# EAGLE design rest (EAGLE 8.7.1)
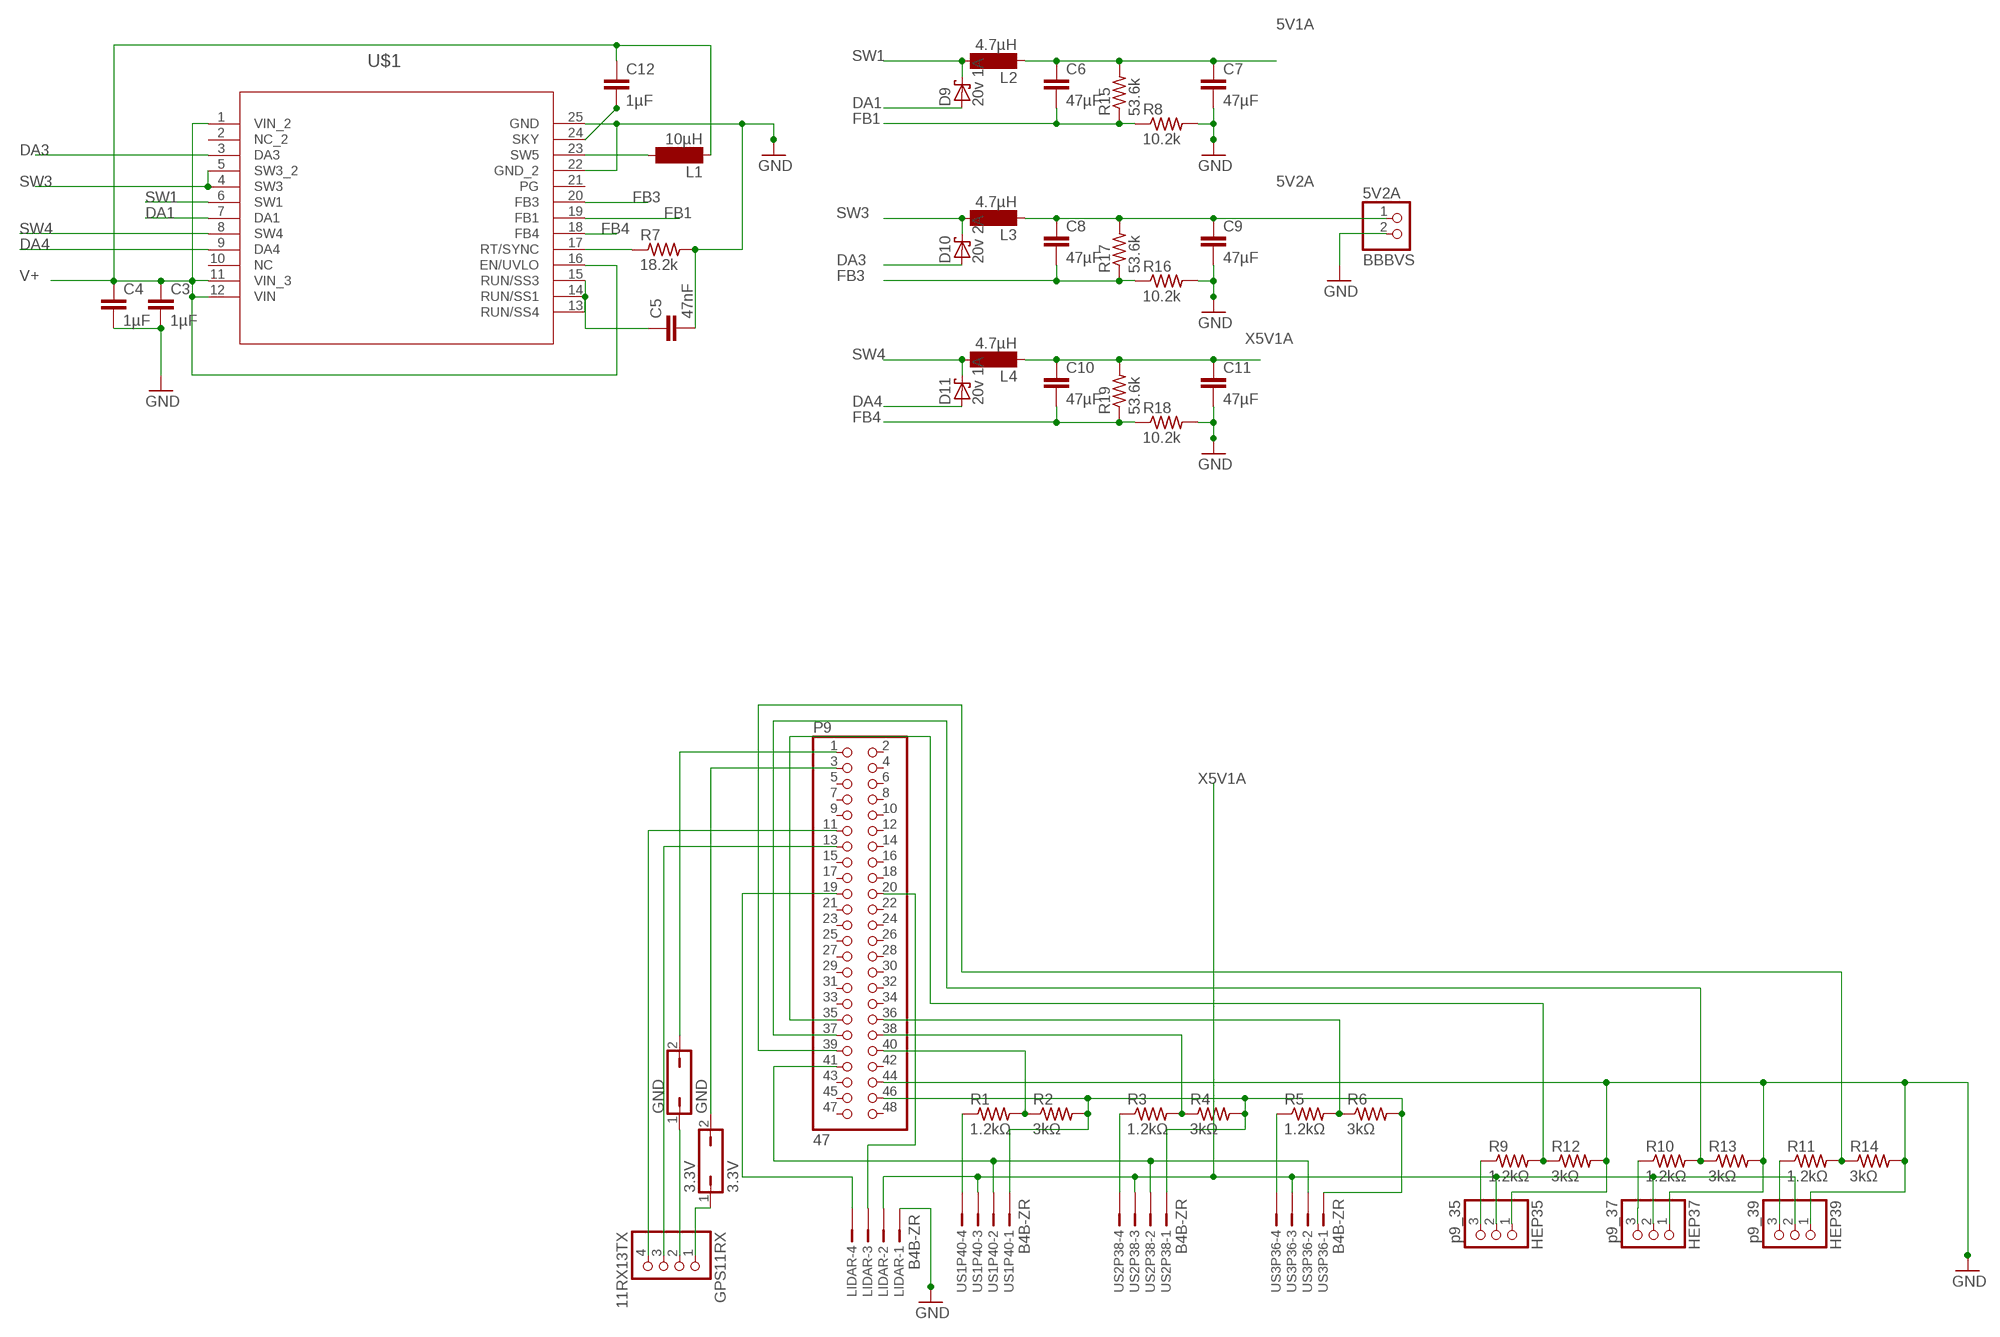
[diagram p0: schematic, sheet 1, part 1 of 2]
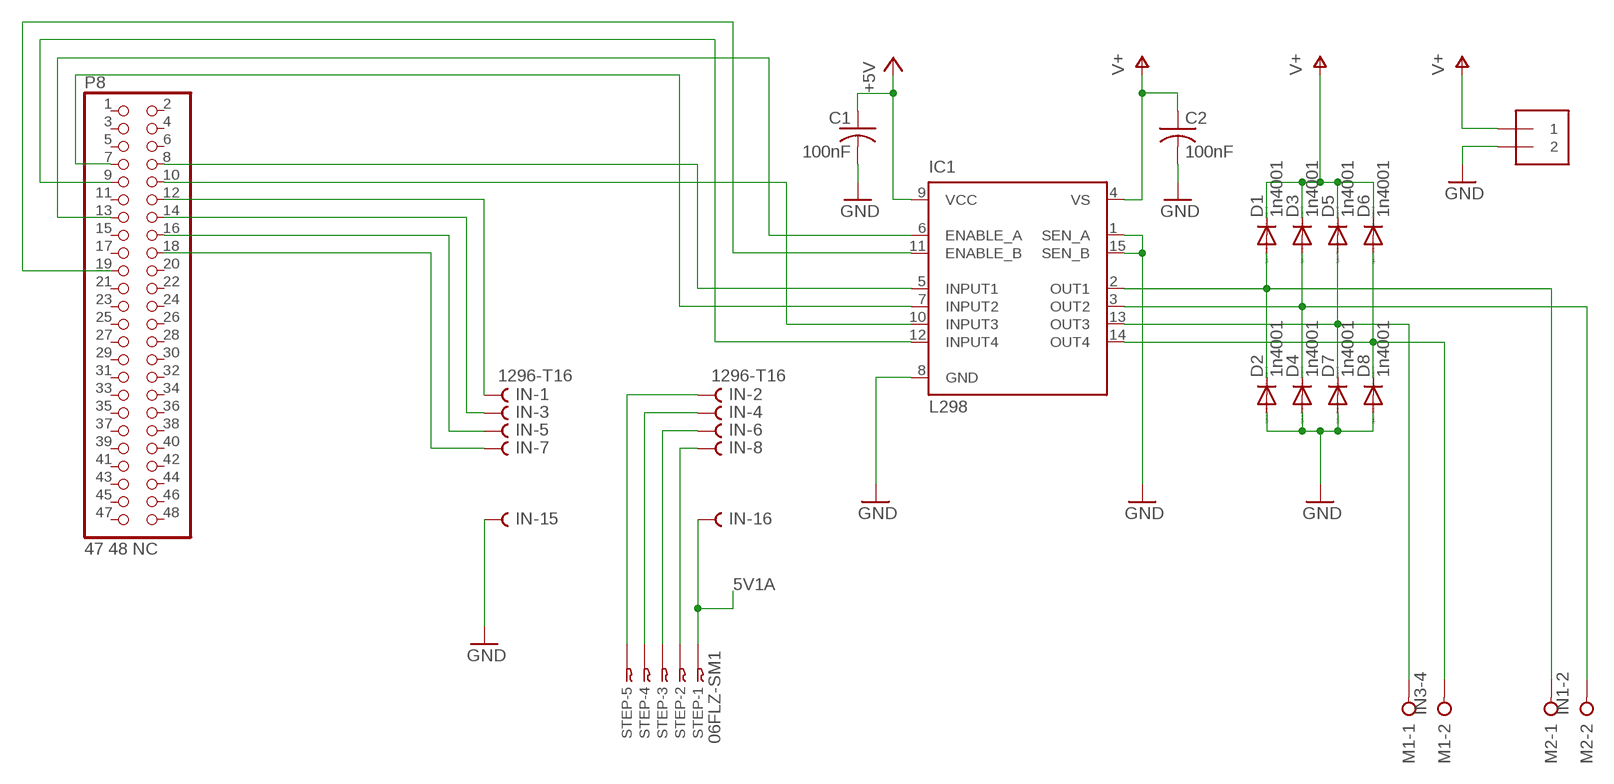
[diagram p1: schematic, sheet 1, part 2 of 2]

## Parts
3.3V  3.3V  JP1Q  [JP1]
5V2A  BBBVS  PINHD-1X2  [1X02]
C1  100nF  C-US050-024X044  [C050-024X044]
C2  100nF  C-US050-024X044  [C050-024X044]
C3  1µF  C2,5-3  [C2.5-3]
C4  1µF  C2,5-3  [C2.5-3]
C5  47nF  C2,5-3  [C2.5-3]
C6  47µF  C2,5-3  [C2.5-3]
C7  47µF  C2,5-3  [C2.5-3]
C8  47µF  C2,5-3  [C2.5-3]
C9  47µF  C2,5-3  [C2.5-3]
C10  47µF  C2,5-3  [C2.5-3]
C11  47µF  C2,5-3  [C2.5-3]
C12  1µF  C2,5-3  [C2.5-3]
D1  1n4001  DIODE-D-5  [D-5]
D2  1n4001  DIODE-D-5  [D-5]
D3  1n4001  DIODE-D-5  [D-5]
D4  1n4001  DIODE-D-5  [D-5]
D5  1n4001  DIODE-D-5  [D-5]
D6  1n4001  DIODE-D-5  [D-5]
D7  1n4001  DIODE-D-5  [D-5]
D8  1n4001  DIODE-D-5  [D-5]
D9  20v 1A  1N5819-T  [DO41-7.6]
D10  20v 2A  1N5819-T  [DO41-7.6]
D11  20v 1A  1N5819-T  [DO41-7.6]
GND  GND  JP1Q  [JP1]
GPS11RX  11RX13TX  PINHD-1X4  [1X04]
HEP35  p9_35  JST_3PIN  [JSTPH3]
HEP37  p9_37  JST_3PIN  [JSTPH3]
HEP39  p9_39  JST_3PIN  [JSTPH3]
IC1  L298  [MULTIWATT-15]
IN  1296-T16  [1296-18]
J1  1X2-3.5MM  [1X2-3.5MM]
L1  10µH  SM-L15A  [SM-L15A]
L2  4.7µH  SM-L15A  [SM-L15A]
L3  4.7µH  SM-L15A  [SM-L15A]
L4  4.7µH  SM-L15A  [SM-L15A]
LIDAR  B4B-ZR  [B4B-ZR]
M1  IN3-4  W237-02P  [W237-132]
M2  IN1-2  W237-02P  [W237-132]
P8  47 48 NC  PINHD-2X24  [2X24]
P9  47  PINHD-2X24  [2X24]
R1  1.2kΩ  R-US_0309/12  [0309/12]
R2  3kΩ  R-US_0309/12  [0309/12]
R3  1.2kΩ  R-US_0309/12  [0309/12]
R4  3kΩ  R-US_0309/12  [0309/12]
R5  1.2kΩ  R-US_0309/12  [0309/12]
R6  3kΩ  R-US_0309/12  [0309/12]
R7  18.2k  R-US_0204/5  [0204/5]
R8  10.2k  R-US_0204/5  [0204/5]
R9  1.2kΩ  R-US_0309/12  [0309/12]
R10  1.2kΩ  R-US_0309/12  [0309/12]
R11  1.2kΩ  R-US_0309/12  [0309/12]
R12  3kΩ  R-US_0309/12  [0309/12]
R13  3kΩ  R-US_0309/12  [0309/12]
R14  3kΩ  R-US_0309/12  [0309/12]
R15  53.6k  R-US_0204/5  [0204/5]
R16  10.2k  R-US_0204/5  [0204/5]
R17  53.6k  R-US_0204/5  [0204/5]
R18  10.2k  R-US_0204/5  [0204/5]
R19  53.6k  R-US_0204/5  [0204/5]
STEP  06FLZ-SM1  [6FLZ-SM]
U$1  LT3514  [TSSOP-24_FEAA]
US1P40  B4B-ZR  [B4B-ZR]
US2P38  B4B-ZR  [B4B-ZR]
US3P36  B4B-ZR  [B4B-ZR]

## Nets
5V1A: C6.1 C7.1 IN.16 L2.1 R15.2 STEP.1
5V2A: 5V2A.1 C8.1 C9.1 L3.1 R17.2
+5V: C1.1 IC1.9(VCC)
DA1: D9.A U$1.7(DA1)
DA3: D10.A U$1.3(DA3)
DA4: D11.A U$1.9(DA4)
FB1: C6.2 R8.1 R15.1 U$1.19(FB1)
FB3: C8.2 R16.1 R17.1 U$1.20(FB3)
FB4: C10.2 R18.1 R19.1 U$1.18(FB4)
GND: 5V2A.2 C1.2 C2.2 C3.2 C4.2 C5.2 C7.2 C9.2 C11.2 D2.A D4.A D7.A D8.A HEP35.1 HEP37.1 HEP39.1 IC1.1(SEN_A) IC1.8(GND) IC1.15(SEN_B) IN.15 J1.2 LIDAR.1 P9.44 R7.2 R8.2 R12.2 R13.2 R14.2 R16.2 R18.2 U$1.22(GND_2) U$1.25(GND)
N$1: P9.40 R1.2 R2.1
N$2: P9.38 R3.2 R4.1
N$3: P9.36 R5.2 R6.1
N$4: R1.1 US1P40.4
N$5: R3.1 US2P38.4
N$6: R5.1 US3P36.4
N$7: P9.46 R2.2 R4.2 R6.2 US1P40.1 US2P38.1 US3P36.1
N$8: P9.41 US1P40.2 US2P38.2 US3P36.2
N$9: D1.A D2.C IC1.2(OUT1) M2.1
N$10: D3.A D4.C IC1.3(OUT2) M2.2
N$11: P9.39 R11.2 R14.1
N$12: P9.37 R10.2 R13.1
N$13: P9.35 R9.2 R12.1
N$14: HEP35.3 R9.1
N$15: HEP37.3 R10.1
N$16: HEP39.3 R11.1
N$17: D6.A D8.C IC1.14(OUT4) M1.2
N$18: D5.A D7.C IC1.13(OUT3) M1.1
N$19: IC1.5(INPUT1) P8.8
N$20: IC1.7(INPUT2) P8.7
N$21: IC1.6(ENABLE_A) P8.13
N$22: IC1.10(INPUT3) P8.10
N$23: IC1.12(INPUT4) P8.9
N$24: IC1.11(ENABLE_B) P8.19
N$25: IN.7 P8.18
N$26: IN.3 P8.14
N$27: IN.1 P8.12
N$28: LIDAR.4 P9.19
N$29: IN.5 P8.16
N$30: IN.2 STEP.5
N$31: IN.4 STEP.4
N$32: IN.6 STEP.3
N$33: IN.8 STEP.2
N$34: LIDAR.3 P9.20
N$37: GPS11RX.4 P9.11
N$38: GPS11RX.3 P9.13
N$39: GND.2 P9.1
N$40: 3.3V.2 P9.3
N$41: GND.1 GPS11RX.2
N$42: 3.3V.1 GPS11RX.1
N$44: C12.2 U$1.24(SKY)
N$45: L1.2 U$1.23(SW5)
N$46: C5.1 U$1.13(RUN/SS4) U$1.14(RUN/SS1) U$1.15(RUN/SS3)
N$47: R7.1 U$1.17(RT/SYNC)
SW1: D9.C L2.2 U$1.6(SW1)
SW3: D10.C L3.2 U$1.4(SW3) U$1.5(SW3_2)
SW4: D11.C L4.2 U$1.8(SW4)
V+: C2.1 C3.1 C4.1 C12.1 D1.C D3.C D5.C D6.C IC1.4(VS) J1.1 L1.1 U$1.1(VIN_2) U$1.11(VIN_3) U$1.12(VIN) U$1.16(EN/UVLO)
X5V1A: C10.1 C11.1 HEP35.2 HEP37.2 HEP39.2 L4.1 LIDAR.2 R19.2 US1P40.3 US2P38.3 US3P36.3
Unconnected: IN.9 IN.10 IN.11 IN.12 IN.13 IN.14 IN.17 IN.18 P8.1 P8.2 P8.3 P8.4 P8.5 P8.6 P8.11 P8.15 P8.17 P8.20 P8.21 P8.22 P8.23 P8.24 P8.25 P8.26 P8.27 P8.28 P8.29 P8.30 P8.31 P8.32 P8.33 P8.34 P8.35 P8.36 P8.37 P8.38 P8.39 P8.40 P8.41 P8.42 P8.43 P8.44 P8.45 P8.46 P8.47 P8.48 P9.2 P9.4 P9.5 P9.6 P9.7 P9.8 P9.9 P9.10 P9.12 P9.14 P9.15 P9.16 P9.17 P9.18 P9.21 P9.22 P9.23 P9.24 P9.25 P9.26 P9.27 P9.28 P9.29 P9.30 P9.31 P9.32 P9.33 P9.34 P9.42 P9.43 P9.45 P9.47 P9.48 STEP.6 U$1.2(NC_2) U$1.10(NC) U$1.21(PG)

## Library data of the parts
3.3V GND = jumper:JP1Q: JUMPER
5V2A = pinhead:PINHD-1X2: PIN HEADER
C1 C2 = rcl:C-US: CAPACITOR, American symbol; SPICEPREFIX: C
C3-C12 = capacitor-wima:C: CAPACITOR naming: grid - package width
D1-D8 = diode:DIODE-: DIODE
D9-D11 = diode:1N581*: 1.0A SCHOTTKY BARRIER RECTIFIER Source: http://www.diodes.com/datasheets/ds23001.pdf
GPS11RX = pinhead:PINHD-1X4: PIN HEADER
HEP35 HEP37 HEP39 = adafruit:JST_3PIN
IC1 = st-microelectronics:L298: DUAL FULL-BRIDGE DRIVER; MPN: L298N; OC_FARNELL: 1589425; OC_NEWARK: 32M1527
IN = con-leotronics:1296-T16: 1.27mm SINGLE ROW FEMALE SOCKET Source: http://www.leotronics.co.uk/Conexcon/Data%20Sheets/sec.%20A/1296ing.pdf; OC_FARNELL: unknown; OC_NEWARK: unknown
J1 = adafruit:1X2: 3.5mm Terminal block http://www.ladyada.net/library/pcb/eaglelibrary.html
L1-L4 = inductor-neosid:SM-L15: INDUCTOR SMD air coil with pick and place cap; OC_FARNELL: unknown; OC_NEWARK: unknown
LIDAR US1P40 US2P38 US3P36 = con-jst:?4B-ZR: ZH CONNECTOR 1.5 mm, 4 pin 1 row Source: http://www.jst.com .. eZH.pdf; MF: FARNELL; MPN: B4B-ZR(LF)(SN); OC_FARNELL: 1830916; OC_NEWARK: 37K9960
M1 M2 = con-wago-508:W237-02P: WAGO SREW CLAMP; OC_FARNELL: unknown; OC_NEWARK: unknown
P8 P9 = pinhead:PINHD-2X24: PIN HEADER
R1-R19 = resistor:R-US_: RESISTOR, American symbol
STEP = con-jst:06FLZ-SM1: CONNECTOR; OC_FARNELL: unknown; OC_NEWARK: unknown
U$1 = LT3514:LT3514: d

## Module LT3514
Ports: 

### Library data of the parts

## Board
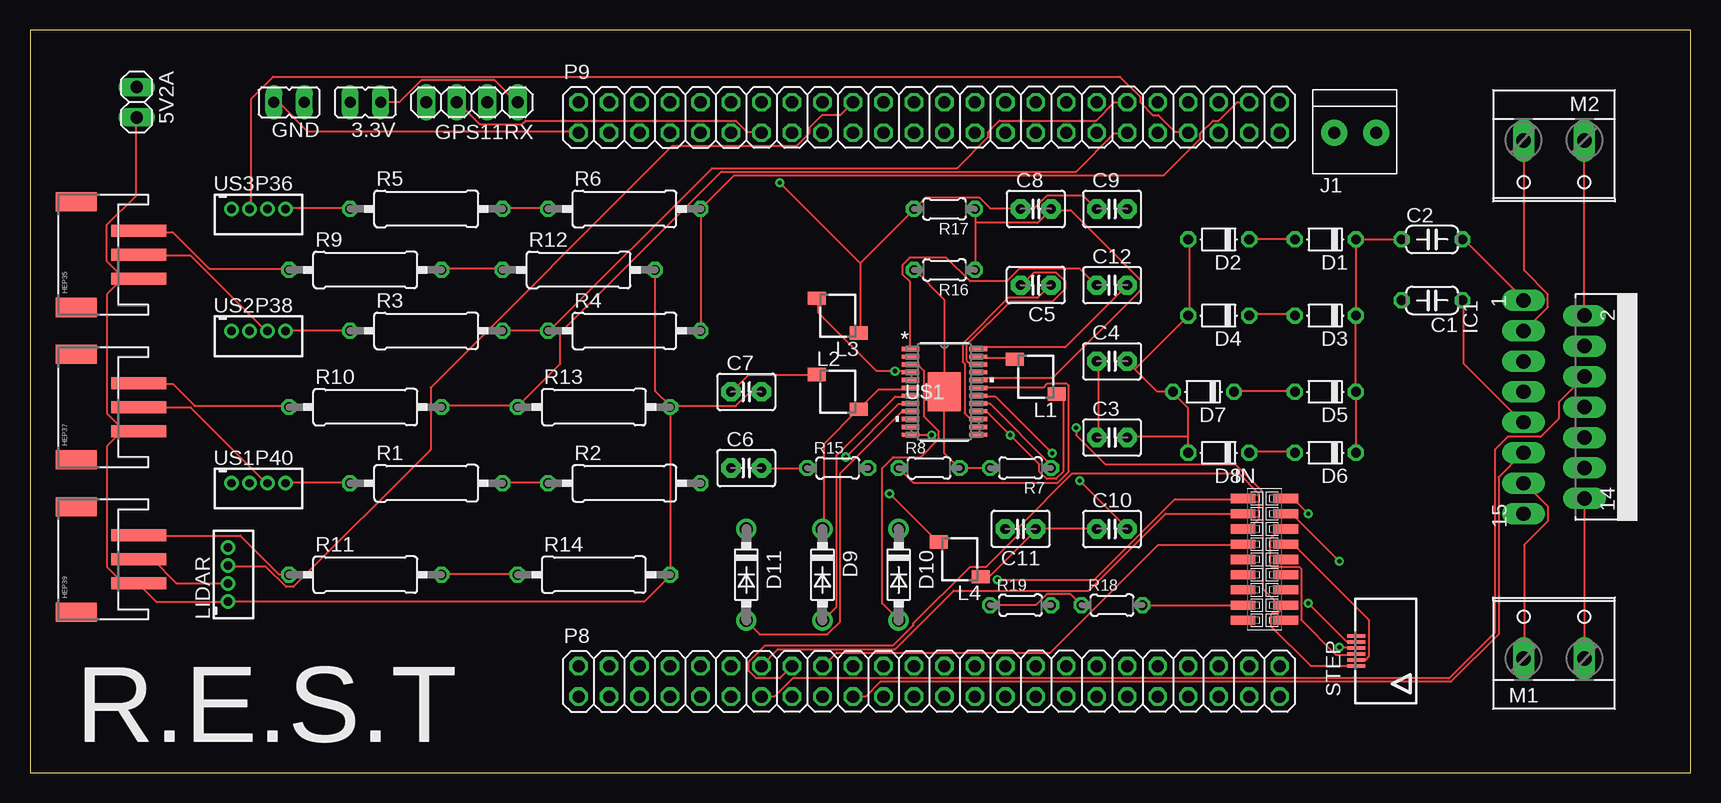
[diagram p2: board, top side]
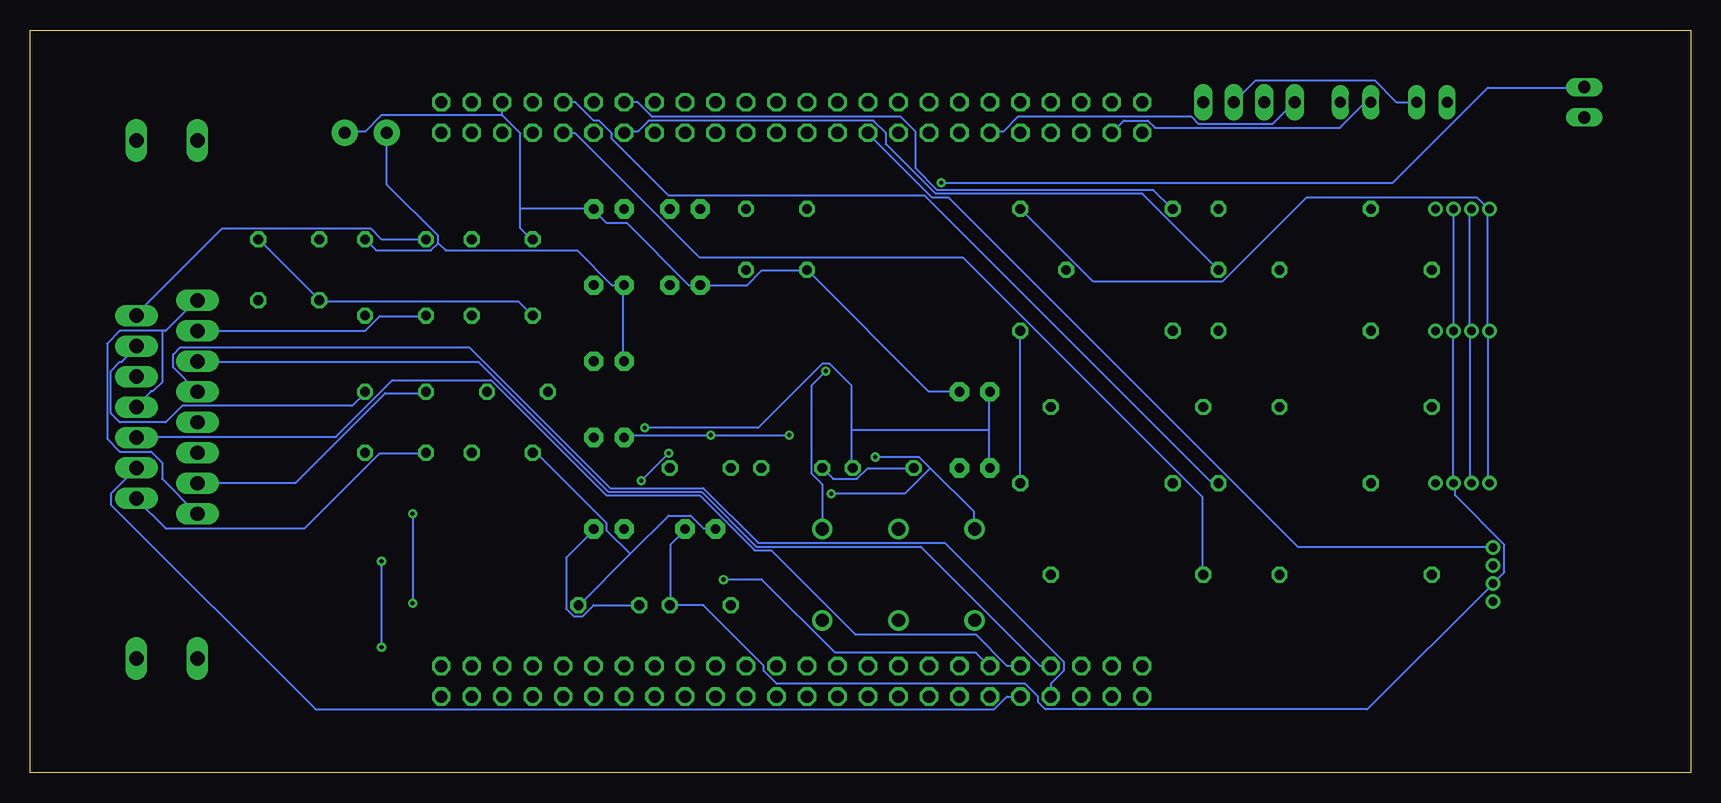
[diagram p3: board, bottom side, seen from below]

Size 138.41 x 61.9 mm. Coordinates in mm from the lower left corner, seen from the top.
Outline: 0,0 138.41,0 138.41,61.9 0,61.9 0,0
Copper layers (1*16): Top 0.035mm / dielectric 1.5mm / Bottom 0.035mm
Design rules "default": minimum track width 6mil, minimum drill 0.35mm, track to track 6mil, track to pad 6mil, pad to pad 6mil, via to via 6mil, smd to smd 6mil, copper to edge 40mil, drill to drill 6mil, minimum pad ring 10mil, minimum via ring 8mil, stop-mask expansion 4mil, vias tented up to drill 0mil, thermal gap 10mil

### Footprints (pad centres in the part's own frame; a part is rotated, then mirrored left to right if it is on the bottom)
JP1 = drill 0.914 long: 1 0,-1.27; 2 0,1.27
1X02 = drill 1.016 long: 1 -1.27,0; 2 1.27,0
C050-024X044 = drill 0.813 octagon: 1 -2.54,0; 2 2.54,0
C2.5-3 = drill 0.813 pad 1.6 octagon: 1 -1.27,0; 2 1.27,0
D-5 = drill 0.813 octagon: A 2.54,0; C -2.54,0
DO41-7.6 = drill 1.1 pad 1.7: A 3.81,0; C -3.81,0
1X04 = drill 1.016 long: 1 -3.81,0; 2 -1.27,0; 3 1.27,0; 4 3.81,0
JSTPH3 = smd 1 x 4.6: 1 -2,-2.7; 2 0,-2.7; 3 2,-2.7 | smd 1.6 x 3.4: NC1 -4.4,2.5; NC2 4.4,2.5
MULTIWATT-15 = drill 1.2 long: 1 -8.89,-7.62; 2 -7.62,-2.54; 3 -6.35,-7.62; 4 -5.08,-2.54; 5 -3.81,-7.62; 6 -2.54,-2.54; 7 -1.27,-7.62; 8 0,-2.54; 9 1.27,-7.62; 10 2.54,-2.54; 11 3.81,-7.62; 12 5.08,-2.54; 13 6.35,-7.62; 14 7.62,-2.54; 15 8.89,-7.62
1296-18 = smd 0.76 x 2.05: 1 -5.08,-1.78; 2 -5.08,1.78; 3 -3.81,-1.78; 4 -3.81,1.78; 5 -2.54,-1.78; 6 -2.54,1.78; 7 -1.27,-1.78; 8 -1.27,1.78; 9 0,-1.78; 10 0,1.78; 11 1.27,-1.78; 12 1.27,1.78; 13 2.54,-1.78; 14 2.54,1.78; 15 3.81,-1.78; 16 3.81,1.78; 17 5.08,-1.78; 18 5.08,1.78
1X2-3.5MM = drill 1 pad 2.184: 1 1.8,0; 2 -1.7,0
SM-L15A = smd 1.1 x 1.5: 1 -1.45,-1.75; 2 1.45,1.75
B4B-ZR = drill 0.7 pad 1.1: 1 -2.25,0; 2 -0.75,0; 3 0.75,0; 4 2.25,0
W237-132 = drill 1.194 long: 1 -2.54,-0.635; 2 2.54,-0.635
2X24 = drill 1.016 octagon: 1 -27.94,-1.27; 2 -27.94,1.27; 3 -25.4,-1.27; 4 -25.4,1.27; 5 -22.86,-1.27; 6 -22.86,1.27; 7 -20.32,-1.27; 8 -20.32,1.27; 9 -17.78,-1.27; 10 -17.78,1.27; 11 -15.24,-1.27; 12 -15.24,1.27; 13 -12.7,-1.27; 14 -12.7,1.27; 15 -10.16,-1.27; 16 -10.16,1.27; 17 -7.62,-1.27; 18 -7.62,1.27; 19 -5.08,-1.27; 20 -5.08,1.27; 21 -2.54,-1.27; 22 -2.54,1.27; 23 0,-1.27; 24 0,1.27; 25 2.54,-1.27; 26 2.54,1.27; 27 5.08,-1.27; 28 5.08,1.27; 29 7.62,-1.27; 30 7.62,1.27; 31 10.16,-1.27; 32 10.16,1.27; 33 12.7,-1.27; 34 12.7,1.27; 35 15.24,-1.27; 36 15.24,1.27; 37 17.78,-1.27; 38 17.78,1.27; 39 20.32,-1.27; 40 20.32,1.27; 41 22.86,-1.27; 42 22.86,1.27; 43 25.4,-1.27; 44 25.4,1.27; 45 27.94,-1.27; 46 27.94,1.27; 47 30.48,-1.27; 48 30.48,1.27
0309/12 = drill 0.813 octagon: 1 -6.35,0; 2 6.35,0
0204/5 = drill 0.813 octagon: 1 -2.54,0; 2 2.54,0
6FLZ-SM = smd 0.3 x 1.5: 1 -1.25,2.5; 2 -0.75,2.5; 3 -0.25,2.5; 4 0.25,2.5; 5 0.75,2.5; 6 1.25,2.5
TSSOP-24_FEAA = smd 1.473 x 0.356: 1 -2.819,3.576; 2 -2.819,2.926; 3 -2.819,2.276; 4 -2.819,1.626; 5 -2.819,0.975; 6 -2.819,0.325; 7 -2.819,-0.325; 8 -2.819,-0.975; 9 -2.819,-1.626; 10 -2.819,-2.276; 11 -2.819,-2.926; 12 -2.819,-3.576; 13 2.819,-3.576; 14 2.819,-2.926; 15 2.819,-2.276; 16 2.819,-1.626; 17 2.819,-0.975; 18 2.819,-0.325; 19 2.819,0.325; 20 2.819,0.975; 21 2.819,1.626; 22 2.819,2.276; 23 2.819,2.926; 24 2.819,3.576 | smd 2.743 x 3.251: 25 0,0

### Placement (x,y rotation side)
3.3V  27.94,55.88 90 top
5V2A  8.89,55.88 270 top
C1  116.84,39.37 180 top
C2  116.84,44.45 0 top
C3  90.17,27.94 0 top
C4  90.17,34.29 0 top
C5  83.82,40.64 180 top
C6  59.69,25.4 0 top
C7  59.69,31.75 0 top
C8  83.82,46.99 0 top
C9  90.17,46.99 0 top
C10  90.17,20.32 0 top
C11  82.55,20.32 180 top
C12  90.17,40.64 0 top
D1  107.95,44.45 180 top
D2  99.06,44.45 180 top
D3  107.95,38.1 180 top
D4  99.06,38.1 180 top
D5  107.95,31.75 180 top
D6  107.95,26.67 180 top
D7  97.79,31.75 180 top
D8  99.06,26.67 180 top
D9  66.04,16.51 270 top
D10  72.39,16.51 270 top
D11  59.69,16.51 270 top
GND  21.59,55.88 90 top
GPS11RX  36.83,55.88 180 top
HEP35  6.35,43.18 90 top
HEP37  6.35,30.48 90 top
HEP39  6.35,17.78 90 top
IC1  132.08,30.48 270 top
IN  102.87,17.78 270 top
J1  110.49,53.34 180 top
L1  83.82,33.02 90 top
L2  67.31,31.75 270 top
L3  67.31,38.1 90 top
L4  77.47,17.78 90 top
LIDAR  16.51,16.51 90 top
M1  127,10.16 0 top
M2  127,52.07 180 top
P8  73.66,7.62 0 top
P9  73.66,54.61 0 top
R1  33.02,24.13 0 top
R2  49.53,24.13 0 top
R3  33.02,36.83 0 top
R4  49.53,36.83 0 top
R5  33.02,46.99 0 top
R6  49.53,46.99 0 top
R7  82.55,25.4 180 top
R8  74.93,25.4 0 top
R9  27.94,41.91 0 top
R10  27.94,30.48 0 top
R11  27.94,16.51 0 top
R12  45.72,41.91 0 top
R13  46.99,30.48 0 top
R14  46.99,16.51 0 top
R15  67.31,25.4 0 top
R16  76.2,41.91 180 top
R17  76.2,46.99 180 top
R18  90.17,13.97 0 top
R19  82.55,13.97 0 top
STEP  113.03,10.16 90 top
U$1  76.2,31.75 0 top
US1P40  19.05,24.13 0 top
US2P38  19.05,36.83 0 top
US3P36  19.05,46.99 0 top

### Tracks (layer width: path | path; a pad name or v marks a point on that pad's centre or on a via)
5V1A  (via drill 0.35)
  Top 0.152: L2.1 65.53,33.17 59.89,33.17 58.52,31.8 C7.1 | v87.17,28.75 87.17,28.14 89.61,25.71 100.43,25.71 102.72,23.42 102.72,15.34 104.09,13.97 IN.16 103.99,13.31 103.53,13.31 103.4,13.17 103.4,12.22 106.71,8.91 STEP.1
  Bottom 0.152: 58.52,28.6 58.52,31.65 C7.1 | 58.52,28.6 58.52,25.4 C6.1 | v87.17,28.75 77.72,28.75 72.39,34.09 71.78,34.09 69.95,32.26 69.95,28.6 | 69.95,28.6 69.95,25.4 R15.2 | 69.95,28.6 58.52,28.6
5V2A  (via drill 0.35)
  Top 0.152: C9.1 87.78,48.11 84.73,48.11 83.67,47.04 82.6,47.04 C8.1 82.45,47.04 80.01,47.04 79.1,47.95 74.68,47.95 73.76,47.04 R17.2 73.61,46.89 69.19,42.47 | 69.19,42.47 69.19,36.68 L3.1 | 69.19,42.47 v62.48,49.17
  Bottom 0.152: v62.48,49.17 24.84,49.17 16.92,57.1 8.99,57.1 5V2A.1
+5V
  Top 0.152: C1.1 119.48,39.27 119.48,34.09 124.36,29.21 IC1.9
DA1
  Top 0.152: U$1.7 73.3,31.34 72.08,31.34 67.21,26.47 67.21,13.82 66.14,12.75 D9.A
DA3
  Top 0.152: U$1.3 73.46,33.93 74.07,33.93 74.52,33.48 74.52,29.67 75.74,28.45 75.74,27.84 74.22,26.31 71.93,26.31 71.02,25.4 71.02,14.12 72.39,12.75 D10.A
DA4
  Top 0.152: U$1.9 72.69,30.12 67.51,24.94 67.51,12.6 66.45,11.53 60.81,11.53 59.74,12.6 D11.A
FB1
  Top 0.152: C6.2 R15.1 | R8.1 73.61,24.18 85.65,24.18 86.56,25.09 86.56,32.26 86.41,32.41 84.73,32.41 84.43,32.11 79.1,32.11 U$1.19
  Bottom 0.152: R15.1 68.58,25.4 69.49,24.49 71.48,24.49 R8.1
FB3
  Top 0.152: 78.79,45.82 78.79,46.89 R17.1 | 78.79,45.82 78.79,42.01 R16.1 | U$1.20 79.1,32.87 85.19,32.87 92.51,40.18 92.51,41.1 86.72,46.89 85.19,46.89 C8.2 85.04,46.89 83.97,45.82 78.79,45.82
FB4  (via drill 0.35)
  Top 0.152: R19.1 83.82,13.97 84.73,14.88 86.72,14.88 R18.1 | v85.19,26.62 80.47,31.34 79.1,31.34 U$1.18 | v87.48,24.33 91.44,20.37 C10.2
  Bottom 0.152: v87.48,24.33 v85.19,26.62 | R18.1 91.44,13.97 92.35,13.06 93.12,13.06 93.73,13.66 93.73,17.93 91.44,20.22 C10.2
GND
  Top 0.152: 7.77,41.25 6.4,42.62 6.4,45.67 8.84,48.11 8.84,54.51 5V2A.2 | 7.77,41.25 8.99,41.25 HEP35.1 7.77,41.25 | 7.77,28.6 8.99,28.6 HEP37.1 7.77,28.6 | 7.77,28.6 6.4,29.97 6.4,39.88 7.77,41.25 | 7.77,28.6 6.4,27.23 6.4,17.17 7.77,15.8 8.99,15.8 HEP39.1 9.14,15.65 10.52,14.27 16.46,14.27 LIDAR.1 16.61,14.27 51.21,14.27 53.34,16.41 R14.2 R13.2 53.34,30.58 | C2.2 119.48,44.45 124.51,39.42 IC1.1 | 53.34,30.58 52.12,31.8 52.12,41.86 R12.2 | 53.34,30.58 58.83,30.58 59.89,31.65 60.96,31.65 C7.2 | R7.2 R8.2 77.42,25.4 76.2,26.62 U$1.25 76.2,39.42 73.76,41.86 R16.2 | U$1.22 78.94,34.09 78.33,34.09 78.03,34.39 78.03,35.61 81.69,39.27 85.19,39.27 86.26,40.33 86.26,40.94 85.5,41.71 83.67,41.71 82.6,40.64 C5.2 | R18.2 IN.15 | 92.05,33.63 91.44,34.24 C4.2 | 92.05,33.63 93.88,31.8 95.25,31.8 D7.A 95.25,31.65 96.47,30.43 96.47,27.99 | 96.47,27.99 96.47,26.77 D8.A | 96.47,27.99 91.44,27.99 C3.2 | D2.A 96.62,44.45 96.62,38.2 D4.A 92.05,33.63
  Bottom 0.152: C2.2 119.33,44.45 114.3,39.42 C1.2 114.3,39.27 97.69,39.27 D4.A | 127.41,36.83 127.1,36.83 124.51,39.42 IC1.1 | 127.41,36.83 130.91,36.83 131.98,35.76 131.98,27.84 130.91,26.77 128.32,26.77 127.41,25.86 127.41,24.49 124.51,21.59 IC1.15 | 127.41,36.83 127.41,32.56 128.17,31.8 128.32,31.8 129.54,30.58 IC1.8 | 88.39,18.24 92.66,13.97 R18.2 | 88.39,18.24 85.19,21.44 83.36,21.44 82.3,20.37 81.38,20.37 C11.2 | 99.06,54.81 P9.44 | 99.06,54.81 97.54,53.29 97.54,47.04 | 97.54,47.04 97.54,45.36 96.62,44.45 D2.A | 97.54,47.04 91.44,47.04 C9.2 91.44,46.89 90.37,45.82 88.7,45.82 83.52,40.64 C5.2 78.64,40.64 77.42,41.86 73.76,41.86 R16.2 63.55,31.8 60.96,31.8 C7.2 | 99.06,54.81 109.12,54.81 110.49,53.44 112.17,53.44 J1.2 | 88.39,18.24 90.37,20.22 90.37,20.83 96.16,26.62 96.47,26.62 D8.A
N$1
  Top 0.152: R1.2 39.47,24.18 43.13,24.18 R2.1
  Bottom 0.152: P9.40 92.96,55.88 91.44,54.36 90.98,54.36 89.92,53.29 89.92,52.83 85.19,48.11 63.86,48.11 39.93,24.18 39.47,24.18 R1.2
N$2
  Top 0.152: R3.2 R4.1 43.28,36.83 56.85,50.39 77.27,50.39 79.86,52.98 79.86,53.44 80.77,54.36 88.85,54.36 90.37,55.88 P9.38
N$3
  Top 0.152: R5.2 39.47,47.04 43.13,47.04 R6.1
  Bottom 0.152: P9.36 87.78,55.88 86.56,54.66 65.84,54.66 64.62,53.44 64.62,50.39 62.79,48.56 44.81,48.56 43.28,47.04 R6.1
N$4
  Top 0.152: US1P40.4 21.34,24.18 26.67,24.18 R1.1
N$5
  Top 0.152: R3.1 US2P38.4
N$6
  Top 0.152: US3P36.4 21.34,47.04 26.67,47.04 R5.1
N$7
  Top 0.152: R4.2 55.93,36.83 55.93,46.89 R6.2 58.67,49.78 94.49,49.78 97.54,52.83 97.54,53.29 98.6,54.36 99.06,54.36 100.58,55.88 P9.46
  Bottom 0.152: 16.92,36.83 16.92,24.18 US1P40.1 | 16.92,36.83 16.92,46.89 US3P36.1 16.92,47.04 17.83,47.95 32,47.95 39.01,40.94 49.84,40.94 R6.2 | 16.92,36.83 US2P38.1 | R2.2 55.93,24.18 55.93,36.83 R4.2
N$8
  Top 0.152: P9.41 96.47,53.44 95.4,53.44 94.03,54.81 93.57,54.81 92.51,55.88 92.51,56.34 90.83,58.01 20.27,58.01 18.44,56.18 18.44,47.04 US3P36.2
  Bottom 0.152: 18.44,36.83 18.44,24.18 US1P40.2 | 18.44,36.83 18.44,46.89 US3P36.2 | 18.44,36.83 US2P38.2
N$9
  Top 0.152: D1.A D2.C | IC1.2 M2.1
  Bottom 0.152: D1.A 109.12,44.45 110.03,45.36 122.38,45.36 129.54,38.2 IC1.2
N$10
  Top 0.152: D4.C 101.65,38.2 105.31,38.2 D3.A | M2.2 124.51,52.68 124.51,41.86 126.49,39.88 126.49,38.81 124.51,36.83 IC1.3
  Bottom 0.152: IC1.3 110.49,36.83 109.27,38.05 105.46,38.05 D3.A
N$11
  Top 0.152: R11.2 34.29,16.56 40.54,16.56 R14.1
  Bottom 0.152: P9.39 93.88,53.29 92.96,53.29 82.6,42.93 60.66,42.93 40.69,22.96 40.69,16.56 R14.1
N$12
  Top 0.152: R10.2 34.29,30.58 40.54,30.58 R13.1 40.69,30.58 44.2,34.09 44.2,36.68 57.61,50.09 87.17,50.09 90.37,53.29 91.44,53.29 P9.37
N$13
  Top 0.152: R9.2 34.29,42.01 39.32,42.01 R12.1
  Bottom 0.152: R12.1 45.72,48.26 62.94,48.26 67.06,52.38 67.06,53.29 68.12,54.36 86.87,54.36 87.78,53.44 88.85,53.44 P9.35
N$14
  Top 0.152: R9.1 21.49,42.01 14.93,42.01 11.89,45.06 9.14,45.06 HEP35.3
N$15
  Top 0.152: R10.1 21.49,30.58 13.72,30.58 11.89,32.41 9.14,32.41 HEP37.3
N$16
  Top 0.152: R11.1 21.49,16.56 20.73,16.56 17.53,19.76 9.14,19.76 HEP39.3
N$17
  Top 0.152: D8.C 101.65,26.77 105.31,26.77 D6.A | IC1.14 M1.2
  Bottom 0.152: D6.A 105.46,26.62 109.27,26.62 115.52,20.37 127.1,20.37 129.54,22.81 IC1.14
N$18
  Top 0.152: D7.C 100.43,31.8 105.31,31.8 D5.A | M1.1 124.51,9.55 124.51,19 126.49,20.98 126.49,22.2 124.51,24.18 IC1.13
  Bottom 0.152: D5.A 105.46,31.65 108.81,31.65 116.28,24.18 124.36,24.18 IC1.13
N$19
  Bottom 0.152: P8.8 53.34,8.94 54.25,8.94 64.16,18.85 77.88,18.85 82.45,23.42 90.22,23.42 101.04,34.24 124.36,34.24 IC1.5
N$20
  Bottom 0.152: P8.7 53.34,7.42 52.27,8.48 52.27,9.25 62.18,19.15 77.72,19.15 82.3,23.72 90.07,23.72 101.8,35.46 125.88,35.46 126.49,34.85 126.49,33.78 IC1.7
N$21
  Top 0.152: P8.13 62.03,6.35 63.55,7.87 118.26,7.87 122.07,11.68 122.07,26.92 123.14,27.99 125.88,27.99 127.41,29.51 127.41,30.89 IC1.6
N$22
  Bottom 0.152: P8.10 55.93,8.94 57,8.94 59.59,11.53 69.65,11.53 76.66,18.54 78.03,18.54 82.6,23.11 90.37,23.11 99.97,32.72 108.2,32.72 112.93,27.99 129.54,27.99 IC1.10
N$23
  Bottom 0.152: P8.9 57,6.35 58.06,5.28 114.6,5.28 131.67,22.35 131.67,23.27 IC1.12
N$24
  Top 0.152: P8.19 69.65,6.35 70.87,7.57 118.41,7.57 122.38,11.53 122.38,24.64 124.36,26.62 IC1.11
N$25
  Top 0.152: IN.7 101.04,19 94.03,19 85.04,10.01 67.21,10.01 66.14,8.94 P8.18
N$26
  Top 0.152: IN.3 94.64,21.59 88.24,15.19 76.96,15.19 72.08,10.31 62.33,10.31 60.96,8.94 P8.14
N$27  (via drill 0.35)
  Top 0.152: v80.62,16.1 88.7,16.1 95.4,22.81 101.04,22.81 IN.1
  Bottom 0.152: v80.62,16.1 77.42,16.1 71.32,10.01 59.59,10.01 58.52,8.94 P8.12
N$28
  Bottom 0.152: LIDAR.4 16.61,18.85 32.77,18.85 61.87,47.95 63.25,47.95 68.58,53.29 P9.19
N$29
  Top 0.152: P8.16 62.48,7.87 60.5,7.87 59.89,8.48 59.89,9.25 61.27,10.62 71.93,10.62 73.61,12.29 73.61,12.45 78.33,17.17 79.7,17.17 82.45,19.91 82.45,20.52 86.87,24.94 100.74,24.94 102.41,23.27 102.41,21.13 101.65,20.37 101.19,20.37 IN.5
N$30  (via drill 0.35)
  Top 0.152: v106.53,14.12 109.73,10.92 110.49,10.92 STEP.5 | v106.53,21.59 105.31,22.81 104.7,22.81 IN.2
  Bottom 0.152: v106.53,21.59 v106.53,14.12
N$31  (via drill 0.35)
  Top 0.152: v109.12,10.46 110.49,10.46 STEP.4 | v109.12,17.63 105.16,21.59 IN.4
  Bottom 0.152: v109.12,17.63 v109.12,10.46
N$32
  Top 0.152: STEP.3 110.49,9.85 108.81,9.85 105.92,12.75 105.92,17.02 105.77,17.17 103.48,17.17 103.33,17.32 103.33,19.46 104.09,20.22 104.55,20.22 IN.6
N$33
  Top 0.152: STEP.2 110.64,9.4 111.25,9.4 111.56,9.7 111.56,12.75 105.31,19 104.7,19 IN.8
N$34
  Top 0.152: P9.20 67.51,54.81 65.99,54.81 64.92,53.75 64.92,53.29 63.86,52.22 53.49,52.22 33.38,32.11 33.38,26.92 21.95,15.49 21.34,15.49 19.66,17.17 16.61,17.17 LIDAR.3
N$37
  Bottom 0.152: P9.11 58.37,53.44 57.3,53.44 56.08,54.66 41.61,54.66 41,54.05 34.9,54.05 33.07,55.88 GPS11RX.4
N$38
  Top 0.152: P9.13 60.96,53.44 59.74,53.44 58.83,54.36 41.3,54.36 41,54.05 37.49,54.05 35.66,55.88 GPS11RX.3
N$39
  Top 0.152: GND.2 20.73,55.88 23.16,53.44 45.72,53.44 P9.1
N$40
  Bottom 0.152: 3.3V.2 27.13,55.88 29.26,53.75 44.65,53.75 45.26,54.36 47.24,54.36 P9.3
N$41
  Bottom 0.152: GND.1 24.54,55.88 26.36,57.71 36.27,57.71 GPS11RX.2
N$42
  Top 0.152: 3.3V.1 30.79,55.88 32.61,57.71 38.71,57.71 40.54,55.88 GPS11RX.1
N$44
  Top 0.152: C12.2 86.26,35.46 79.1,35.46 U$1.24
N$45
  Top 0.152: U$1.23 79.1,34.54 81.99,34.54 L1.2
N$46
  Top 0.152: U$1.13 79.1,28.3 79.1,28.75 U$1.14 79.1,28.9 79.1,29.36 U$1.15 78.94,29.51 78.33,29.51 77.88,29.97 77.88,34.09 77.72,34.24 77.72,35.76 81.53,39.57 83.97,39.57 85.04,40.64 C5.1
N$47
  Top 0.152: U$1.17 79.1,30.73 80.01,30.73 85.04,25.71 85.04,25.4 R7.1
SW1
  Top 0.152: U$1.6 73.3,31.95 70.71,31.95 69.19,30.43 L2.2 69.04,30.28 66.14,27.38 66.14,20.37 D9.C
SW3  (via drill 0.35)
  Top 0.152: U$1.5 73.46,32.87 73.46,33.33 U$1.4 73.3,33.48 v72.08,33.48 70.56,33.48 65.68,38.35 65.68,39.42 L3.2
  Bottom 0.152: D10.C 72.39,24.03 73.3,24.94 73.3,32.26 v72.08,33.48
SW4  (via drill 0.35)
  Top 0.152: v67.97,26.31 72.39,30.73 73.3,30.73 U$1.8 | v71.63,23.27 75.59,19.3 L4.2
  Bottom 0.152: v67.97,26.31 64.31,26.31 63.4,25.4 | 63.4,25.4 59.74,21.74 59.74,20.37 D11.C | v71.63,23.27 65.53,23.27 63.4,25.4
V+  (via drill 0.35)
  Top 0.152: U$1.16 79.7,30.12 v81.69,28.14 84.12,25.71 84.12,25.09 84.73,24.49 85.5,24.49 86.11,25.09 86.11,31.04 85.65,31.5 L1.1 | U$1.11 73.46,28.75 73.46,28.3 U$1.12 73.46,28.14 v75.13,28.14 | U$1.1 73.3,35.46 73.3,40.94 72.69,41.55 72.69,42.32 73.3,42.93 76.35,42.93 78.33,40.94 81.38,40.94 82.45,42.01 87.48,42.01 88.85,40.64 C12.1 | C3.1 89,27.99 89,34.24 C4.1 | C2.1 D1.C D3.C D5.C D6.C
  Bottom 0.152: v75.13,28.14 v81.69,28.14 88.7,28.14 C3.1 | 89,40.64 89,34.39 C4.1 | 104.39,44.14 104.39,44.75 108.66,49.02 108.66,53.29 J1.1 | 104.39,44.14 105,43.54 109.58,43.54 D1.C | IC1.4 129.54,35.46 130.76,34.24 130.91,34.24 131.67,33.48 131.67,29.97 130.91,29.21 127.1,29.21 125.73,30.58 111.56,30.58 110.49,31.65 D5.C | 89,40.64 89.92,40.64 92.81,43.54 103.78,43.54 104.39,44.14 | 89,40.64 C12.1
X5V1A
  Top 0.152: HEP35.2 9.14,43.08 13.41,43.08 19.66,36.83 US2P38.3 | L4.1 79.25,16.41 80.01,16.41 83.82,20.22 C11.1 83.82,20.37 88.85,20.37 C10.1 | HEP39.2 10.21,17.78 12.19,15.8 16.46,15.8 LIDAR.2 | HEP37.2 9.14,30.43 13.41,30.43 19.66,24.18 US1P40.3
  Bottom 0.152: 19.81,36.83 19.81,46.89 US3P36.3 | 85.04,13.97 85.04,19 83.82,20.22 C11.1 | 85.04,13.97 82.3,13.97 77.27,8.94 77.27,8.48 76.2,7.42 55.47,7.42 54.41,6.35 54.41,5.89 53.8,5.28 26.97,5.28 16.61,15.65 LIDAR.2 16.46,15.8 15.54,16.71 15.54,19 19.66,23.11 19.66,24.03 US1P40.3 19.81,24.18 19.81,36.83 | 85.04,13.97 R19.2 | 19.81,36.83 US2P38.3

### Text on the board
top_silk: R.E.S.T